# Altium schematic sheet D_OUTPUT_RELAY.SchDoc
size A4; SheetNumber: 2; SheetTotal: 9
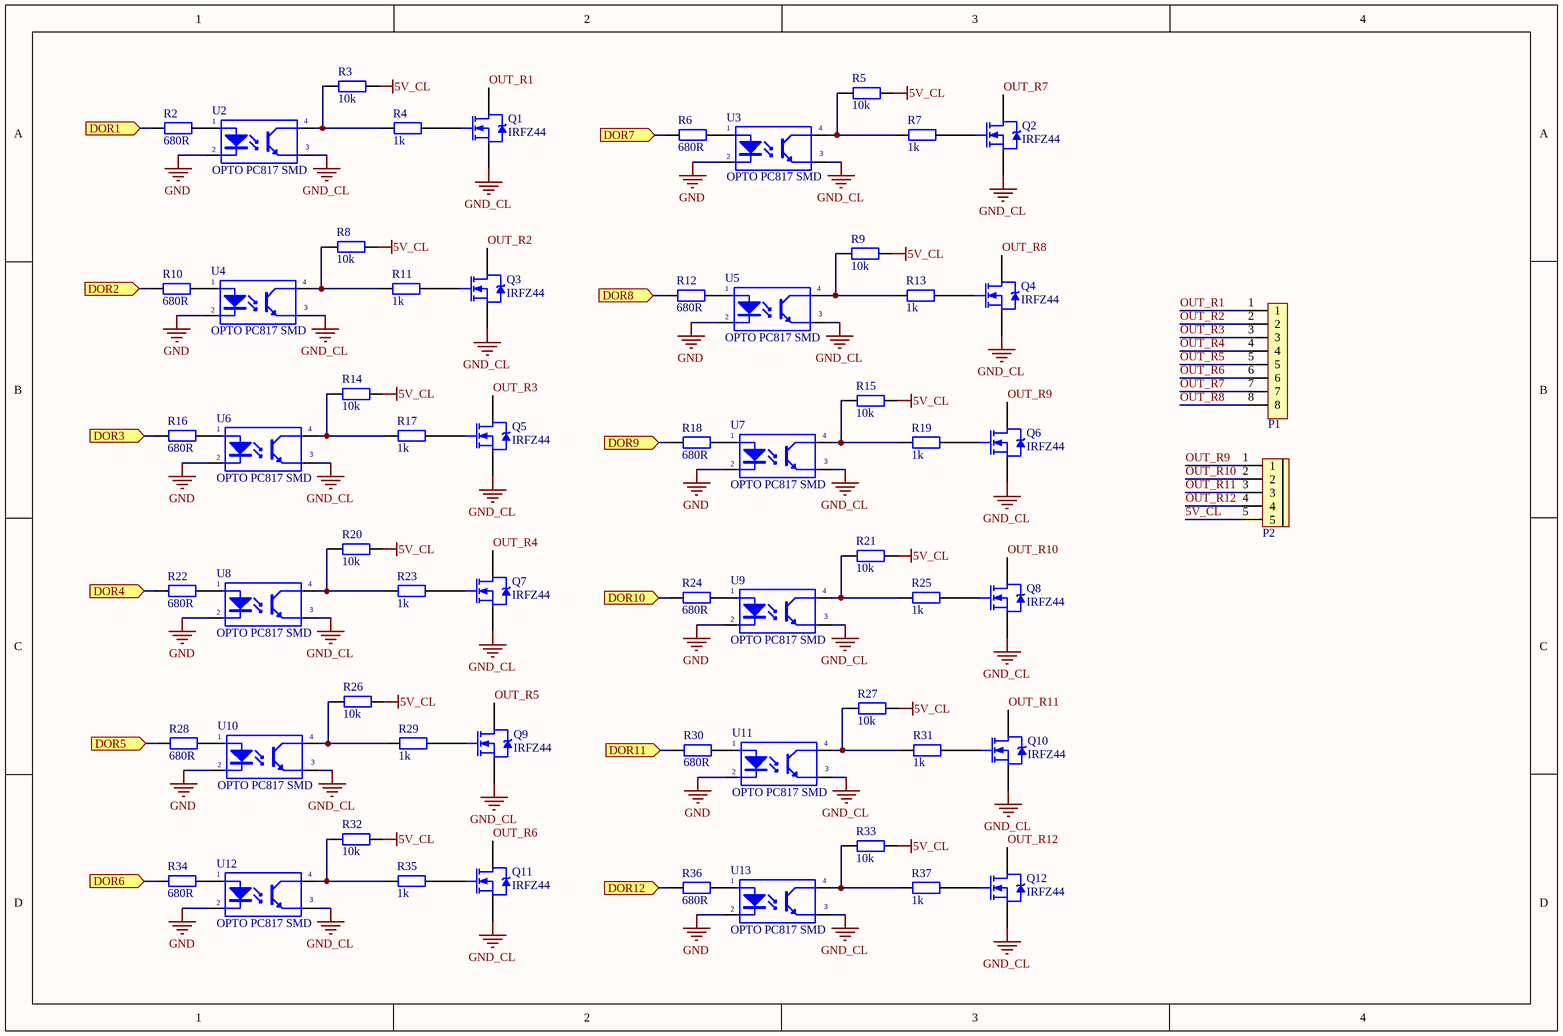
[diagram p0: D_OUTPUT_RELAY.SchDoc]

## Parts
P1  CON 8 EDG5.08  [CON 8 8EDG5.08]  (value not drawn)
P2  CON 5 EDG5.08  [CON 5 5EDG5.08]  (value not drawn)
Q1  IRFZ44  [TO220]
Q2  IRFZ44  [TO220]
Q3  IRFZ44  [TO220]
Q4  IRFZ44  [TO220]
Q5  IRFZ44  [TO220]
Q6  IRFZ44  [TO220]
Q7  IRFZ44  [TO220]
Q8  IRFZ44  [TO220]
Q9  IRFZ44  [TO220]
Q10  IRFZ44  [TO220]
Q11  IRFZ44  [TO220]
Q12  IRFZ44  [TO220]
R2  680R  [tro smd 0805]
R3  10k  [tro smd 0805]
R4  1k  [tro smd 0805]
R5  10k  [tro smd 0805]
R6  680R  [tro smd 0805]
R7  1k  [tro smd 0805]
R8  10k  [tro smd 0805]
R9  10k  [tro smd 0805]
R10  680R  [tro smd 0805]
R11  1k  [tro smd 0805]
R12  680R  [tro smd 0805]
R13  1k  [tro smd 0805]
R14  10k  [tro smd 0805]
R15  10k  [tro smd 0805]
R16  680R  [tro smd 0805]
R17  1k  [tro smd 0805]
R18  680R  [tro smd 0805]
R19  1k  [tro smd 0805]
R20  10k  [tro smd 0805]
R21  10k  [tro smd 0805]
R22  680R  [tro smd 0805]
R23  1k  [tro smd 0805]
R24  680R  [tro smd 0805]
R25  1k  [tro smd 0805]
R26  10k  [tro smd 0805]
R27  10k  [tro smd 0805]
R28  680R  [tro smd 0805]
R29  1k  [tro smd 0805]
R30  680R  [tro smd 0805]
R31  1k  [tro smd 0805]
R32  10k  [tro smd 0805]
R33  10k  [tro smd 0805]
R34  680R  [tro smd 0805]
R35  1k  [tro smd 0805]
R36  680R  [tro smd 0805]
R37  1k  [tro smd 0805]
U2  OPTO PC817 SMD  [SOP4]
U3  OPTO PC817 SMD  [SOP4]
U4  OPTO PC817 SMD  [SOP4]
U5  OPTO PC817 SMD  [SOP4]
U6  OPTO PC817 SMD  [SOP4]
U7  OPTO PC817 SMD  [SOP4]
U8  OPTO PC817 SMD  [SOP4]
U9  OPTO PC817 SMD  [SOP4]
U10  OPTO PC817 SMD  [SOP4]
U11  OPTO PC817 SMD  [SOP4]
U12  OPTO PC817 SMD  [SOP4]
U13  OPTO PC817 SMD  [SOP4]

## Ports
DOR1 (in), DOR2 (in), DOR3 (in), DOR4 (in), DOR5 (in), DOR6 (in), DOR7 (in), DOR8 (in), DOR9 (in), DOR10 (in), DOR11 (in), DOR12 (in)

## Nets
5V_CL: P2.5 R3.1 R5.1 R8.1 R9.1 R14.1 R15.1 R20.1 R21.1 R26.1 R27.1 R32.1 R33.1
GND: U2.2(K) U3.2(K) U4.2(K) U5.2(K) U6.2(K) U7.2(K) U8.2(K) U9.2(K) U10.2(K) U11.2(K) U12.2(K) U13.2(K)
GND_CL: Q1.3(S) Q2.3(S) Q3.3(S) Q4.3(S) Q5.3(S) Q6.3(S) Q7.3(S) Q8.3(S) Q9.3(S) Q10.3(S) Q11.3(S) Q12.3(S) U2.3(E) U3.3(E) U4.3(E) U5.3(E) U6.3(E) U7.3(E) U8.3(E) U9.3(E) U10.3(E) U11.3(E) U12.3(E) U13.3(E)
DOR1: R2.1 ; port DOR1
DOR2: R10.1 ; port DOR2
DOR3: R16.1 ; port DOR3
DOR4: R22.1 ; port DOR4
DOR5: R28.1 ; port DOR5
DOR6: R34.1 ; port DOR6
DOR7: R6.1 ; port DOR7
DOR8: R12.1 ; port DOR8
DOR9: R18.1 ; port DOR9
DOR10: R24.1 ; port DOR10
DOR11: R30.1 ; port DOR11
DOR12: R36.1 ; port DOR12
OUT_R1: P1.1 Q1.2(D)
OUT_R2: P1.2 Q3.2(D)
OUT_R3: P1.3 Q5.2(D)
OUT_R4: P1.4 Q7.2(D)
OUT_R5: P1.5 Q9.2(D)
OUT_R6: P1.6 Q11.2(D)
OUT_R7: P1.7 Q2.2(D)
OUT_R8: P1.8 Q4.2(D)
OUT_R9: P2.1 Q6.2(D)
OUT_R10: P2.2 Q8.2(D)
OUT_R11: P2.3 Q10.2(D)
OUT_R12: P2.4 Q12.2(D)
NetQ1_1: Q1.1(G) R4.2
NetQ2_1: Q2.1(G) R7.2
NetQ3_1: Q3.1(G) R11.2
NetQ4_1: Q4.1(G) R13.2
NetQ5_1: Q5.1(G) R17.2
NetQ6_1: Q6.1(G) R19.2
NetQ7_1: Q7.1(G) R23.2
NetQ8_1: Q8.1(G) R25.2
NetQ9_1: Q9.1(G) R29.2
NetQ10_1: Q10.1(G) R31.2
NetQ11_1: Q11.1(G) R35.2
NetQ12_1: Q12.1(G) R37.2
NetR2_2: R2.2 U2.1(A)
NetR3_2: R3.2 R4.1 U2.4(C)
NetR5_2: R5.2 R7.1 U3.4(C)
NetR6_2: R6.2 U3.1(A)
NetR8_2: R8.2 R11.1 U4.4(C)
NetR9_2: R9.2 R13.1 U5.4(C)
NetR10_2: R10.2 U4.1(A)
NetR12_2: R12.2 U5.1(A)
NetR14_2: R14.2 R17.1 U6.4(C)
NetR15_2: R15.2 R19.1 U7.4(C)
NetR16_2: R16.2 U6.1(A)
NetR18_2: R18.2 U7.1(A)
NetR20_2: R20.2 R23.1 U8.4(C)
NetR21_2: R21.2 R25.1 U9.4(C)
NetR22_2: R22.2 U8.1(A)
NetR24_2: R24.2 U9.1(A)
NetR26_2: R26.2 R29.1 U10.4(C)
NetR27_2: R27.2 R31.1 U11.4(C)
NetR28_2: R28.2 U10.1(A)
NetR30_2: R30.2 U11.1(A)
NetR32_2: R32.2 R35.1 U12.4(C)
NetR33_2: R33.2 R37.1 U13.4(C)
NetR34_2: R34.2 U12.1(A)
NetR36_2: R36.2 U13.1(A)

## Library data of the parts
P1 = CON 8 EDG5.08: Cắm; Ten_Linh_Kien: CON 8 2EDG5.08-8P 5.08MM ( Xanh Cong); Ma_Hang: MH000978; Don_Vi: Con; Ghi_Chu: *; Kieu_Chan: *; Chung_Loai: Cắm
P2 = CON 5 EDG5.08: Cắm; Ten_Linh_Kien: CON 5 2EDG5.08-5P 5.08MM ( Xanh Cong); Ma_Hang: MH003589; Kieu_Chan: *; Don_Vi: Con; Ghi_Chu: *; Chung_Loai: Cắm
Q1-Q12 = IRFZ44 DIP: N-Channel Power MOSFET
R2 R6 R10 R12 R16 R18 R22 R24 R28 R30 R34 R36 = Tro 0805 1% 680R: Dán; Don_Vi: Con; So_Chan: 2; Ten_Linh_Kien: Trở 0805 1% 680R; Ma_Hang: MH005487; Chung_Loai: Dán; Kieu_Chan: *
R3 R5 R8 R9 R14 R15 R20 R21 R26 R27 R32 R33 = Tro 0805 1% 10k: Dán; Don_Vi: Con; So_Chan: 2; Ten_Linh_Kien: Trở 0805 1% 10k; Ma_Hang: MH005473; Chung_Loai: Dán; Kieu_Chan: *
R4 R7 R11 R13 R17 R19 R23 R25 R29 R31 R35 R37 = Tro 0805 1% 1k: Dán; Don_Vi: Con; So_Chan: 2; Ten_Linh_Kien: Trở 0805 1% 1k; Ma_Hang: MH005468; Chung_Loai: Dán; Kieu_Chan: *
U2-U13 = OPTO PC817 SMD: Single Opto; Value: PC817